# Altium schematic sheet FAR.SchDoc
size A4
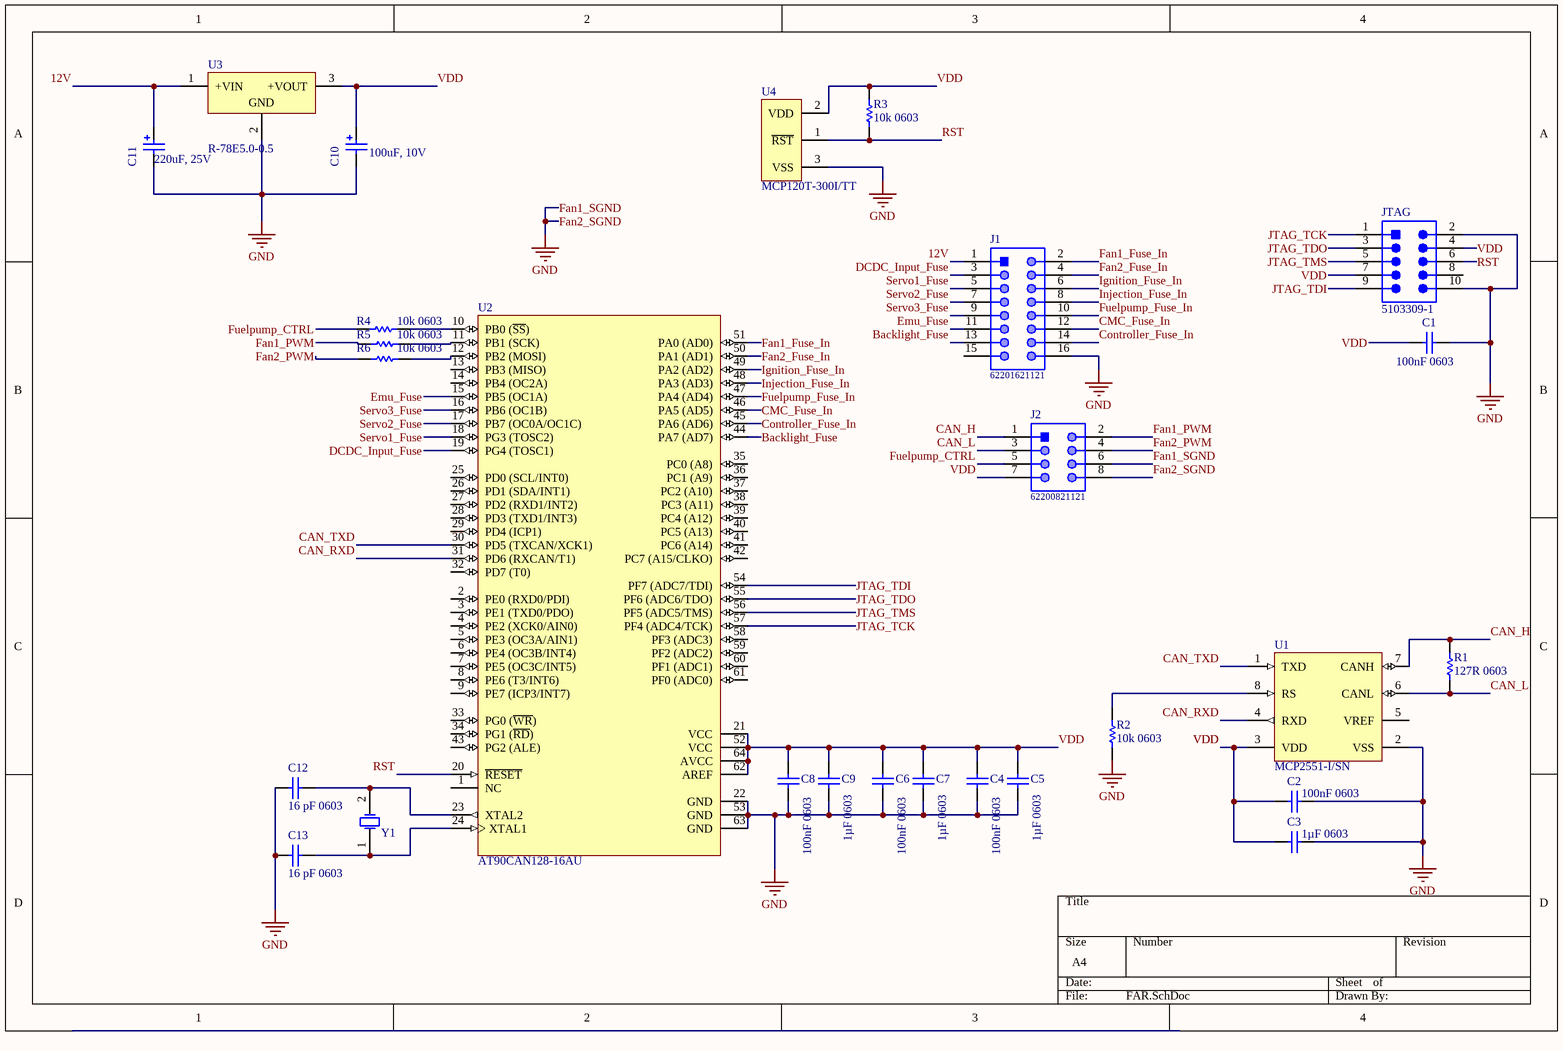
[diagram p0: FAR.SchDoc]

## Parts
C1  100nF 0603  [CAPC0603(1608)100_L]
C2  100nF 0603  [CAPC0603(1608)100_L]
C3  1µF 0603  [CAPC0603(1608)100_L]
C4  100nF 0603  [CAPC0603(1608)100_L]
C5  1µF 0603  [CAPC0603(1608)100_L]
C6  100nF 0603  [CAPC0603(1608)100_L]
C7  1µF 0603  [CAPC0603(1608)100_L]
C8  100nF 0603  [CAPC0603(1608)100_L]
C9  1µF 0603  [CAPC0603(1608)100_L]
C10  100uF, 10V  [WCAP-ASLU_6.3x7.7]
C11  220uF, 25V  [WCAP-ATET_10x12.5]
C12  16 pF 0603  [CAPC0603(1608)100_L]
C13  16 pF 0603  [CAPC0603(1608)100_L]
J1  62201621121  [62201621121]
J2  62200821121  [62200821121]
JTAG  5103309-1  [TECO-5103309-1_V]
R1  127R 0603  [RESC0603(1608)_N]
R2  10k 0603  [RESC0603(1608)_N]
R3  10k 0603  [RESC0603(1608)_N]
R4  10k 0603  [RESC0603(1608)_N]
R5  10k 0603  [RESC0603(1608)_N]
R6  10k 0603  [RESC0603(1608)_N]
U1  MCP2551-I/SN  [MCHP-SN8_V]
U2  AT90CAN128-16AU  [64A_M]
U3  R-78E5.0-0.5  [REPO-R-78E-0.5-3_V]
U4  MCP120T-300I/TT  [SOT-23-TT3_N]
Y1  16MHz, +/-30ppm, 16pF  [WE-XTAL_HC49/4HSMX]  (value not drawn)

## Nets
Fan1_SGND: C1.2 C2.2 C3.2 C4.1 C5.1 C6.1 C7.1 C8.1 C9.1 C10.1(N) C11.1(N) C12.2 C13.2 J1.16 J2.6 J2.8 JTAG.2 JTAG.10 R2.1 U1.2(VSS) U2.22(GND) U2.53(GND) U2.63(GND) U3.2(GND) U4.3(VSS)  [also labelled Fan2_SGND, GND]
12V: C11.2(P) J1.1 U3.1(+VIN)
Backlight_Fuse: J1.13 U2.44(PA7_(AD7))
CAN_H: J2.1 R1.2 U1.7(CANH)
CAN_L: J2.3 R1.1 U1.6(CANL)
CAN_RXD: U1.4(RXD) U2.31(PD6_(RXCAN/T1))
CAN_TXD: U1.1(TXD) U2.30(PD5_(TXCAN/XCK1))
CMC_Fuse_In: J1.12 U2.46(PA5_(AD5))
Controller_Fuse_In: J1.14 U2.45(PA6_(AD6))
DCDC_Input_Fuse: J1.3 U2.19(PG4_(TOSC1))
Emu_Fuse: J1.11 U2.15(PB5_(OC1A))
Fan1_Fuse_In: J1.2 U2.51(PA0_(AD0))
Fan1_PWM: J2.2 R5.1
Fan2_Fuse_In: J1.4 U2.50(PA1_(AD1))
Fan2_PWM: J2.4 R6.1
Fuelpump_CTRL: J2.5 R4.1
Fuelpump_Fuse_In: J1.10 U2.47(PA4_(AD4))
Ignition_Fuse_In: J1.6 U2.49(PA2_(AD2))
Injection_Fuse_In: J1.8 U2.48(PA3_(AD3))
JTAG_TCK: JTAG.1 U2.57(PF4_(ADC4/TCK))
JTAG_TDI: JTAG.9 U2.54(PF7_(ADC7/TDI))
JTAG_TDO: JTAG.3 U2.55(PF6_(ADC6/TDO))
JTAG_TMS: JTAG.5 U2.56(PF5_(ADC5/TMS))
RST: JTAG.6 R3.2 U2.20(~{RESET}) U4.1(~{RST})
Servo1_Fuse: J1.5 U2.18(PG3_(TOSC2))
Servo2_Fuse: J1.7 U2.17(PB7_(OC0A/OC1C))
Servo3_Fuse: J1.9 U2.16(PB6_(OC1B))
VDD: C1.1 C2.1 C3.1 C4.2 C5.2 C6.2 C7.2 C8.2 C9.2 C10.2(P) J2.7 JTAG.4 JTAG.7 R3.1 U1.3(VDD) U2.21(VCC) U2.52(VCC) U2.62(AREF) U2.64(AVCC) U3.3(+VOUT) U4.2(VDD)
NetC12_1: C12.1 U2.23(XTAL2) Y1.2(OSC2)
NetC13_1: C13.1 U2.24(XTAL1) Y1.1(OSC1)
NetR2_2: R2.2 U1.8(RS)
NetR4_2: R4.2 U2.10(PB0_(~{SS}))
NetR5_2: R5.2 U2.11(PB1_(SCK))
NetR6_2: R6.2 U2.12(PB2_(MOSI))

Not connected (* = marked no-connect by the designer): J1 15; JTAG 8; U1 5(VREF); U2 1(NC) 2(PE0_(RXD0/PDI)) 3(PE1_(TXD0/PDO)) 4(PE2_(XCK0/AIN0)) 5(PE3_(OC3A/AIN1)) 6(PE4_(OC3B/INT4)) 7(PE5_(OC3C/INT5)) 8(PE6_(T3/INT6)) 9(PE7_(ICP3/INT7)) 13(PB3_(MISO)) 14(PB4_(OC2A)) 25(PD0_(SCL/INT0)) 26(PD1_(SDA/INT1)) 27(PD2_(RXD1/INT2)) 28(PD3_(TXD1/INT3)) 29(PD4_(ICP1)) 32(PD7_(T0)) 33(PG0_(~{WR})) 34(PG1_(~{RD})) 35(PC0_(A8)) 36(PC1_(A9)) 37(PC2_(A10)) 38(PC3_(A11)) 39(PC4_(A12)) 40(PC5_(A13)) 41(PC6_(A14)) 42(PC7_(A15/CLKO)) 43(PG2_(ALE)) 58(PF3_(ADC3)) 59(PF2_(ADC2)) 60(PF1_(ADC1)) 61(PF0_(ADC0))

## Library data of the parts
C1-C9 C12 C13 = CMP-1035-02579-1: CAP 100nF 10V ±5% 0603 (1608 Metric) Thickness 1mm SMD; Tolerance: Â±5%; Case-EIA: 0603; Case-Metric: 1608; Value: 100nF; Max Thickness: 1 mm; Rated Voltage: 10 V; Technology: SMT
C10 = 865090245005: WCAP-ASLU Aluminium Electrolytic Capacitors, D6.3mm x L7.7mm, 100uF, +/-20%, 10VDC; Dissipation Factor: 22%; Leakage Current: 2uA; Endurance: 1000h; Technical Reference: ASBD077101M010DVCTCA000; Ripple Current max.: 75mA; ComponentLink1Description: Manufacturer; ComponentLink1URL: http://www.we-online.de; ComponentLink2Description: Datasheet; ComponentLink2URL: https://katalog.we-online.com/pbs/datasheet/865090245005.pdf; Mounting Technology: SMD; Operating Temperature: -40 to +85degC; Packaging: Tape and Reel; Part Number: 865090245005; Publisher: Wurth Elektronik; Capacitance: 100uF; Diameter: 6.3mm; Length: 7.7mm; Published Date: August 2019; Rated Voltage: 10VDC; Capacitance Tolerance: +/-20%
C11 = 860130475006: WCAP-ATET THT Aluminum Electrolytic Capacitors, D10mm x L12.5mm, 220uF, +/-20%, 25VDC; Dissipation Factor: 13%; Endurance: 2000h; Leakage Current: 55uA; Ripple Current max.: 420mA; Technical Reference: ATGF125221M025DSPA9B000; ComponentLink1Description: Manufacturer; ComponentLink1URL: http://www.we-online.de; ComponentLink2Description: Datasheet; ComponentLink2URL: https://katalog.we-online.com/pbs/datasheet/860130475006.pdf; Length: 12.5mm; Mounting Technology: THT; Operating Temperature: -40 to +125degC; Packaging: Ammo Pack; Published Date: August 2019; Capacitance: 220uF; Diameter: 10mm; Part Number: 860130475006; Publisher: Wurth Elektronik; Capacitance Tolerance: +/-20%; Rated Voltage: 25VDC
J1 = CMP-1502-00950-1: THT Vertical Pin Header WR-PHD, Pitch 1.27 mm, Dual Row, 16 pins; Manufacturer: Wurth Elektronik; Gender: Male; Working Voltage: 100VAC; Rated Current: 1A; Pin Number: 16; Pitch: 1.27mm; Contact Resistance: 20mOhm; Withstanding Voltage: 500VAC; Publisher: WurthElektronik; Package Reference: 62201621121; Part Number: 62201621121; Packaging: Box; Row Number: Dual; Mounting Technology: THT; Operating Temperature: -40to105degC; Manufacturer URL: http://www.we-online.de; Orientation: Vertical; Datasheet URL: https://katalog.we-online.de/em/datasheet/62201621121.pdf
J2 = CMP-1502-00947-1: THT Vertical Pin Header WR-PHD, Pitch 1.27 mm, Dual Row, 8 pins; Manufacturer: Wurth Elektronik; Contact Resistance: 20mOhm; Pin Number: 8; Rated Current: 1A; Gender: Male; Working Voltage: 100VAC; Withstanding Voltage: 500VAC; Pitch: 1.27mm; Package Reference: 62200821121; Publisher: WurthElektronik; Packaging: Box; Operating Temperature: -40to105degC; Manufacturer URL: http://www.we-online.de; Row Number: Dual; Mounting Technology: THT; Part Number: 62200821121; Orientation: Vertical; Datasheet URL: https://katalog.we-online.de/em/datasheet/62200821121.pdf
JTAG = CMP-2000-07502-1: Male Header, Pitch 2.54 mm, 2 x 5 Position, Height 9.855 mm, Tail Length 3.048 mm, -65 to 105 degC, RoHS, Tube; Manufacturer: TE Connectivity; PCB Mounting Orientation: Vertical; Pitch: 2.54mm; Mating Connector Lock: No(Without); Body Material: Thermoplastic; Shrouded: Yes(With); Connector System: Wire-to-Board; Insulation Resistance: 5GR; Number of Positions: 10; Max Current Rating: 1A; PCB Mount Retention: Without; Manufacturer URL: http://www.te.com/; Contact Plating: Gold; Datasheet URL: http://www.te.com/commerce/DocumentDelivery/DDEController?Action=showdoc&DocId=Customer+Drawing%7F5103309%7FE1%7Fpdf%7FEnglish%7FENG_CD_5103309_E1.pdf%7F5103309-1; Colour: Black; Termination: ThroughHole; Housing Colour: Black; Flammability Rating: UL94V-0; Package Description: Male Header, Pitch 2.54 mm, 2 x 5 Position, Height 9.855 mm, Tail Length 3.048 mm; Mating Retention: No(Without); Orientation: Straight; Row Spacing: 2.54mm; Termination Post Length: 0.12inch; Min Operating Temperature: -65degC; Board Standoff: Yes(With); REACH SVHC: NoSVHC; Depth: 9.14mm; Lead Free: LeadFree; Gender: Male; Connector Type: Header; Shrouded End Dimension: 3.81mm; ELV: Compliant; Mating Alignment: Yes(With); Panel Mount Retention: No(Without); Package Quantity: 35; PCB Mount Alignment: No(Without); Number of Rows: 2; Package Reference: 5103309-1; Mounting Technology: ThroughHole; Mount: ThroughHole; Contact Gender: Male; Number of Contacts: 10; Length: 0.8inch; Current Rating: 1A; Contact Mating Length: 0.24inch; Max Operating Temperature: 105degC; RoHSCompliant: True; Datasheet Version: Rev. E1, 03/2011; Contact Shape: Square; Height: 8.813mm; Housing Material: PBT; Contact Material: CopperAlloy; Packaging: Rail/Tube
R1-R6 = CMP-1012-00408-1: 127R 0.1W 1% 0603 (1608 Metric)  SMD; Case-Metric: 1608; Value: 127.00 Ohm; Case-EIA: 0603; Power: 0.1 W; Tolerance: 1 %; Technology: SMT
U1 = CMP-1721-00003-1: High-Speed CAN Transceiver, / 1 Mb/s, 4.5 to 5.5 V, 8-Pin SOIC (SN), Industrial Temperature, RoHS, Tube; Manufacturer: Microchip; RoHSCompliant: true; PackageReference: SN8; ComponentLink1URL: http://www.microchip.com/; DatasheetVersion: Rev. F, 07/2010; ComponentLink2Description: Datasheet; ComponentLink2URL: http://ww1.microchip.com/downloads/en/DeviceDoc/21667f.pdf; ComponentLink3Description: Package Specification; PackageDescription: 8-Pin Small Outline Integrated Circuit, Body 4.9 x 3.9 mm, Pitch 1.27 mm; ComponentLink1Description: Manufacturer URL; Mounting Technology: Surface Mount; ComponentLink3URL: http://www.microchip.com/stellent/groups/techpub_sg/documents/packagingspec/en012702.pdf
U2 = CMP-0096-00104-1: 8-bit AVR Microcontroller, 128KB Flash and CAN Controller, 53 GPIO pins, Industrial Grade (-40° to +85°C), 64-pin LQFP, Green; PackageVersion: revB, Oct-2001; PackageReference: 64A; PackageDescription: 64-Pin Plastic Thin Profile Quad Flat Pack, 14 x 14 x 1.0 mm Body, 0.8 mm Pitch (TQFP); DatasheetVersion: revH, Aug-2008; Code_JEDEC: MS-026-AEB
U3 = CMP-2000-06922-2: DC/DC-Converter, 5 V Single Output, 500 mA, -40 to 85 degC, 3-Pin THD, RoHS, Tube; Manufacturer: Recom Power; Efficiency: 92%; Number of Outputs: 1; Current - Output (Max): 500mA; VIN Min: 7V; Package Version: Rev. 0; VIN Max: 28V; VOUT: 5V; Manufacturer URL: http://www.recom-power.com/us/americas/home.html; Operating Temperature: -40°C~85°C; Datasheet Version: 01/2017; Packaging: Tube; Package Reference: SIP Module; Datasheet URL: http://www.recom-power.com/pdf/Innoline/R-78Exx-0.5.pdf; Package Description: 3-Pin Through Hole Device, Body 11.6 x 8.5 mm, Pitch 2.54 mm; Mounting Technology: ThroughHole
U4 = CMP-0138-00362-1: Microcontroller Supervisory Circuit with Open Drain Output, 3-Pin SOT-23, Industrial Temperature, Tape and Reel; PackageDescription: 3-Lead Plastic Small Outline Transistor (TT) [SOT-23]; PackageVersion: revBB, Aug-2009; PackageReference: SOT-23-TT3; Code_IPC: SOT23-3; DatasheetVersion: revD, 2001
Y1 = 830003237: WE-XTAL Quartz Crystal, size HC49-4HSMX, 16MHz, +/-30ppm, 16pF; Frequency Stability: 50ppm; ComponentLink1Description: Manufacturer; ComponentLink1URL: http://www.we-online.de; ComponentLink2Description: Datasheet; ComponentLink2URL: https://katalog.we-online.com/pbs/datasheet/830003237.pdf; Part Number: 830003237; Published Date: March 2019; Publisher: Wurth Elektronik; Size: HC49-4HSMX; Operating Temperature: -10 up to +60degC; Mounting Technology: SMT; Packaging: Tape and Reel; Load Capacitance: 16pF; Frequency Tolerance: +/-30ppm; Frequency: 16MHz